# EAGLE design plooter 2 (EAGLE 8.2.1)
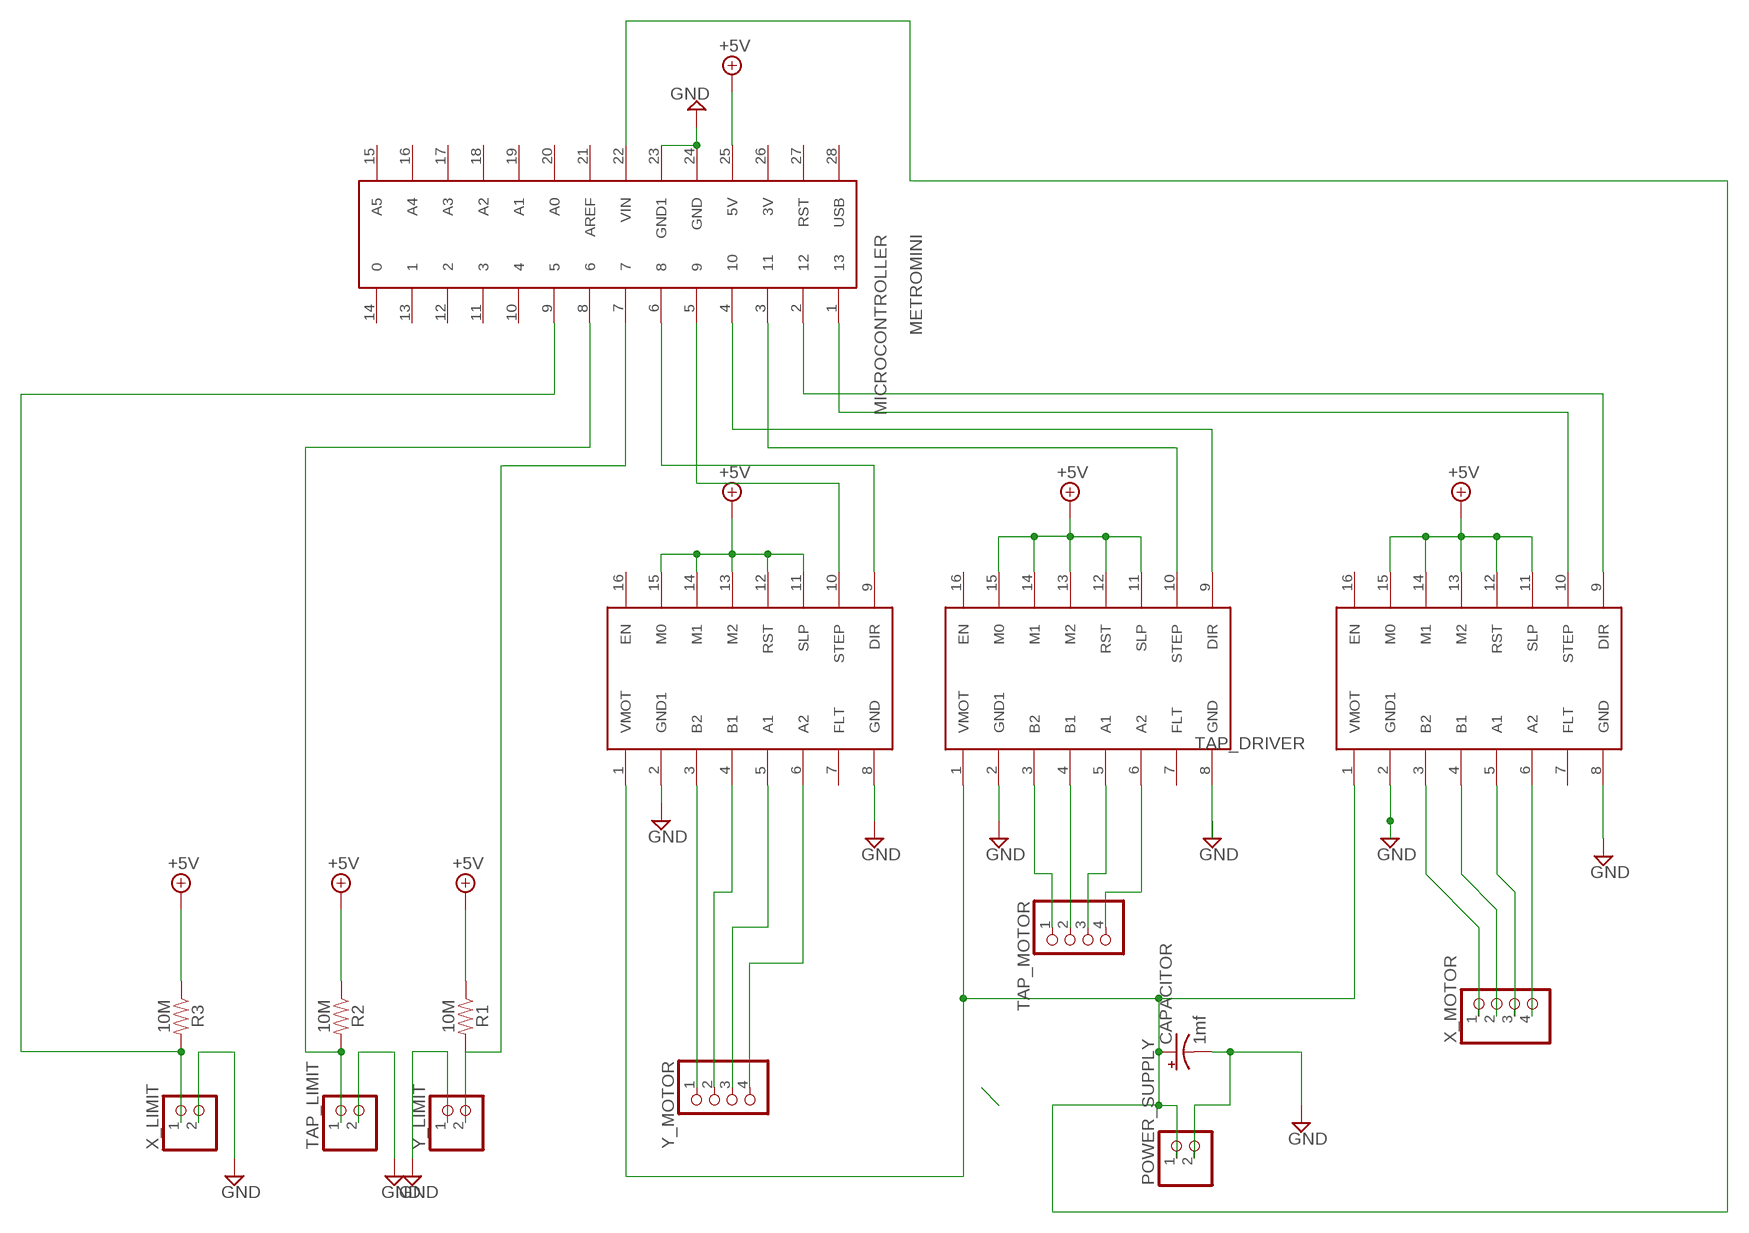
[diagram p0: schematic, sheet 1]

## Parts
CAPACITOR  1mf  1000UF-RADIAL-5MM-35V-20%-KIT  [CPOL-RADIAL-5MM-10MM-KIT]
MICROCONTROLLER  METROMINI  [METROMINI]
POWER_SUPPLY  PINHD-1X2  [1X02]
R1  10M  10MOHM-HORIZ-1/4W-5%  [AXIAL-0.3]
R2  10M  10MOHM-HORIZ-1/4W-5%  [AXIAL-0.3]
R3  10M  10MOHM-HORIZ-1/4W-5%  [AXIAL-0.3]
TAP_DRIVER  DRV8825  [DRV8825]
TAP_LIMIT  PINHD-1X2  [1X02]
TAP_MOTOR  PINHD-1X4  [1X04]
X_DRIVER  DRV8825  [DRV8825]
X_LIMIT  PINHD-1X2  [1X02]
X_MOTOR  PINHD-1X4  [1X04]
Y_DRIVER  DRV8825  [DRV8825]
Y_LIMIT  PINHD-1X2  [1X02]
Y_MOTOR  PINHD-1X4  [1X04]

## Nets
12V [power]: CAPACITOR.+ MICROCONTROLLER.22(VIN) POWER_SUPPLY.1 TAP_DRIVER.1(VMOT) X_DRIVER.1(VMOT) Y_DRIVER.1(VMOT)
+5V [power]: MICROCONTROLLER.25(5V) R1.P$1 R2.P$1 R3.P$1 TAP_DRIVER.11(SLP) TAP_DRIVER.12(RST) TAP_DRIVER.13(M2) TAP_DRIVER.14(M1) TAP_DRIVER.15(M0) X_DRIVER.11(SLP) X_DRIVER.12(RST) X_DRIVER.13(M2) X_DRIVER.14(M1) X_DRIVER.15(M0) Y_DRIVER.11(SLP) Y_DRIVER.12(RST) Y_DRIVER.13(M2) Y_DRIVER.14(M1) Y_DRIVER.15(M0)
GND [gnd]: CAPACITOR.- MICROCONTROLLER.23(GND1) MICROCONTROLLER.24(GND) POWER_SUPPLY.2 TAP_DRIVER.2(GND1) TAP_DRIVER.8(GND) TAP_LIMIT.2 X_DRIVER.2(GND1) X_DRIVER.8(GND) X_LIMIT.2 Y_DRIVER.2(GND1) Y_DRIVER.8(GND) Y_LIMIT.1
N$1: MICROCONTROLLER.7 R1.P$2 Y_LIMIT.2
N$2: MICROCONTROLLER.5 Y_DRIVER.10(STEP)
N$4: MICROCONTROLLER.9 R3.P$2 X_LIMIT.1
N$6: MICROCONTROLLER.6 Y_DRIVER.9(DIR)
N$7: MICROCONTROLLER.3 TAP_DRIVER.10(STEP)
N$8: MICROCONTROLLER.4 TAP_DRIVER.9(DIR)
N$9: MICROCONTROLLER.1 X_DRIVER.10(STEP)
N$11: MICROCONTROLLER.2 X_DRIVER.9(DIR)
N$12: MICROCONTROLLER.8 R2.P$2 TAP_LIMIT.1
N$20: TAP_DRIVER.3(B2) TAP_MOTOR.1
N$21: TAP_DRIVER.4(B1) TAP_MOTOR.2
N$23: TAP_DRIVER.6(A2) TAP_MOTOR.4
N$24: X_DRIVER.3(B2) X_MOTOR.1
N$25: X_DRIVER.4(B1) X_MOTOR.2
N$26: X_DRIVER.5(A1) X_MOTOR.3
N$27: X_DRIVER.6(A2) X_MOTOR.4
N$39: Y_DRIVER.4(B1) Y_MOTOR.2
N$44: TAP_DRIVER.5(A1) TAP_MOTOR.3
N$45: Y_DRIVER.3(B2) Y_MOTOR.1
N$46: Y_DRIVER.5(A1) Y_MOTOR.3
N$48: Y_DRIVER.6(A2) Y_MOTOR.4
Unconnected: MICROCONTROLLER.10 MICROCONTROLLER.11 MICROCONTROLLER.12 MICROCONTROLLER.13 MICROCONTROLLER.14 MICROCONTROLLER.15(A5) MICROCONTROLLER.16(A4) MICROCONTROLLER.17(A3) MICROCONTROLLER.18(A2) MICROCONTROLLER.19(A1) MICROCONTROLLER.20(A0) MICROCONTROLLER.21(AREF) MICROCONTROLLER.26(3V) MICROCONTROLLER.27(RST) MICROCONTROLLER.28(USB) TAP_DRIVER.7(FLT) TAP_DRIVER.16(EN) X_DRIVER.7(FLT) X_DRIVER.16(EN) Y_DRIVER.7(FLT) Y_DRIVER.16(EN)

## Library data of the parts
CAPACITOR = SparkFun-Capacitors:1000UF: 1,000µF/1mF ceramic capacitors A capacitor is a passive two-terminal electrical component used to store electrical energy temporarily in an electric field. CAP-08070; PROD_ID: CAP-09538
MICROCONTROLLER = julian:METROMINI
POWER_SUPPLY TAP_LIMIT X_LIMIT Y_LIMIT = pinhead:PINHD-1X2: PIN HEADER
R1-R3 = SparkFun-Resistors:10MOHM: RES-09327; PROD_ID: RES-09327
TAP_DRIVER X_DRIVER Y_DRIVER = julian:DRV8825
TAP_MOTOR X_MOTOR Y_MOTOR = pinhead:PINHD-1X4: PIN HEADER

## Net classes
0 default: width 0.457 mm, drill 0.457 mm, clearance 0.457 mm
1 power: width 0.457 mm, drill 0.457 mm, clearance 0.457 mm
2 gnd: width 0.457 mm, drill 0.457 mm, clearance 0.457 mm
3 usbvcc: width 0.457 mm, drill 0.457 mm, clearance 0.457 mm
4 aref: width 0.254 mm, drill 0.457 mm, clearance 0.457 mm

## Board
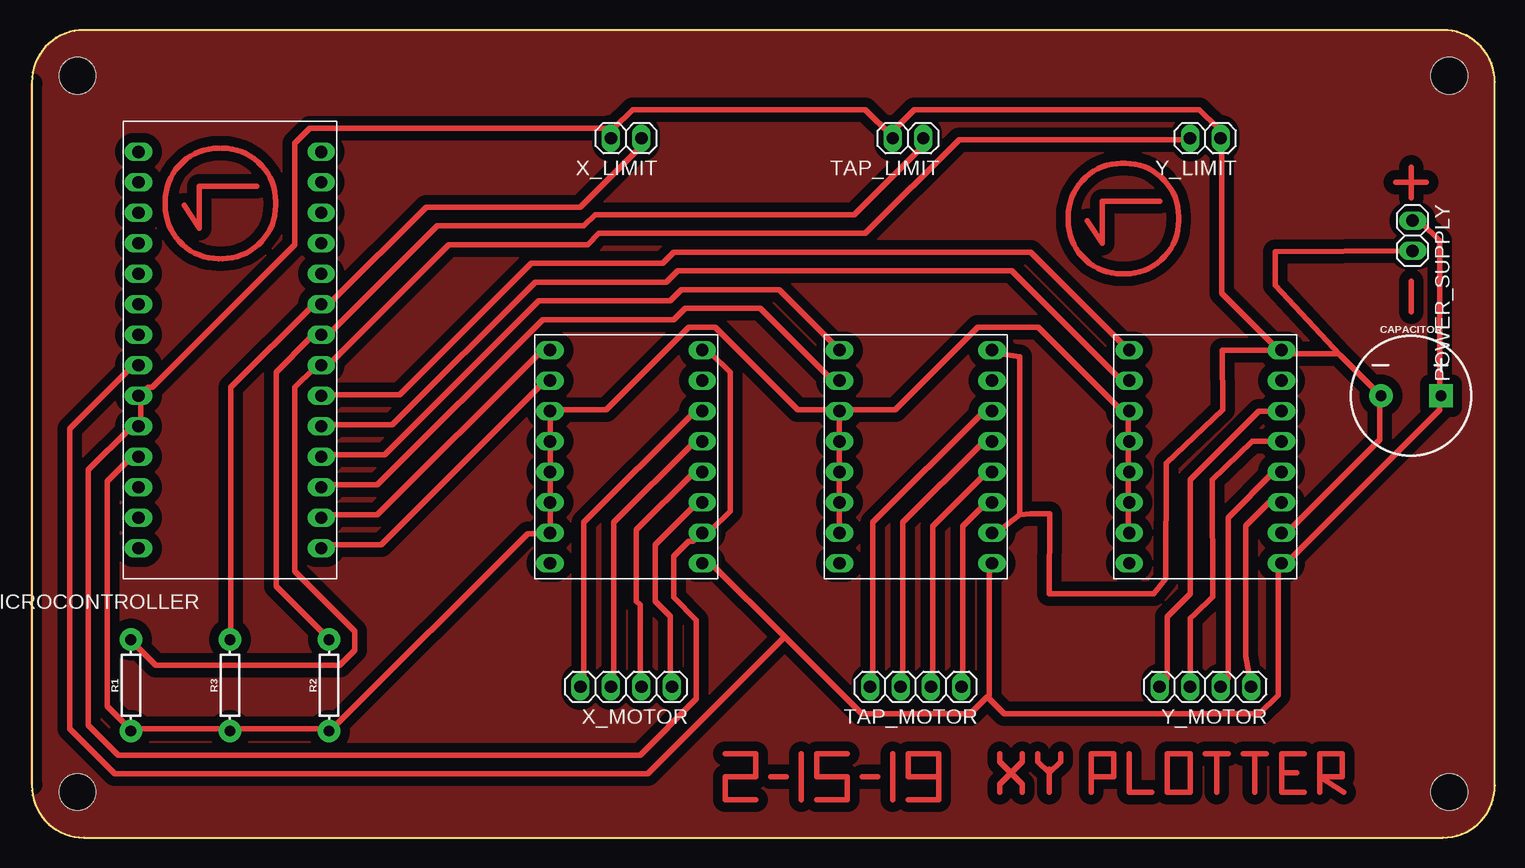
[diagram p1: board, top side]

Size 121.92 x 67.31 mm. Coordinates in mm from the lower left corner, seen from the top.
Outline: 117.58,67.31 4.34,67.31 arc90 0,62.97 0,4.34 arc90 4.34,0 117.58,0 arc90 121.92,4.34 121.92,62.97 arc90 117.58,67.31
Copper layers (1*16): Top 0.035mm / dielectric 1.5mm / Bottom 0.035mm
Design rules "OthermillDRC_1_32_v2": minimum track width 8mil, minimum drill 0.8mm, track to track 0.794003125mm, track to pad 0.794003125mm, pad to pad 0.794003125mm, via to via 0.794003125mm, smd to smd 0mil, copper to edge 0mil, drill to drill 1mil, minimum pad ring 10mil, minimum via ring 10mil, stop-mask expansion 1mil, vias tented up to drill 30mil, thermal gap 10mil
Holes 3.05 mm at 3.81,3.81 118.11,3.81 118.11,63.5 3.81,63.5

### Footprints (pad centres in the part's own frame; a part is rotated, then mirrored left to right if it is on the bottom)
CPOL-RADIAL-5MM-10MM-KIT = drill 0.9 pad 1.93 square: + 2.5,0 | drill 0.9 pad 1.93: - -2.5,0
METROMINI = drill 1.016 long: 1 -16.51,-3.81; 2 -13.97,-3.81; 3 -11.43,-3.81; 4 -8.89,-3.81; 5 -6.35,-3.81; 6 -3.81,-3.81; 7 -1.27,-3.81; 8 1.27,-3.81; 9 3.81,-3.81; 10 6.35,-3.81; 11 8.89,-3.81; 12 11.43,-3.81; 13 13.97,-3.81; 14 16.51,-3.81; 15 16.51,11.43; 16 13.97,11.43; 17 11.43,11.43; 18 8.89,11.43; 19 6.35,11.43; 20 3.81,11.43; 21 1.27,11.43; 22 -1.27,11.43; 23 -3.81,11.43; 24 -6.35,11.43; 25 -8.89,11.43; 26 -11.43,11.43; 27 -13.97,11.43; 28 -16.51,11.43
1X02 = drill 1.016 long: 1 -1.27,0; 2 1.27,0
AXIAL-0.3 = drill 0.9 pad 1.88: P$1 -3.81,0; P$2 3.81,0
DRV8825 = drill 1.016 long: 1 -7.62,-1.27; 2 -5.08,-1.27; 3 -2.54,-1.27; 4 0,-1.27; 5 2.54,-1.27; 6 5.08,-1.27; 7 7.62,-1.27; 8 10.16,-1.27; 9 10.16,11.43; 10 7.62,11.43; 11 5.08,11.43; 12 2.54,11.43; 13 0,11.43; 14 -2.54,11.43; 15 -5.08,11.43; 16 -7.62,11.43
1X04 = drill 1.016 long: 1 -3.81,0; 2 -1.27,0; 3 1.27,0; 4 3.81,0

### Placement (x,y rotation side)
CAPACITOR  114.94,36.83 0 top
MICROCONTROLLER  20.32,40.64 90 top
POWER_SUPPLY  115.06,50.16 270 top
R1  8.26,12.7 90 top
R2  24.77,12.7 90 top
R3  16.51,12.7 90 top
TAP_DRIVER  78.74,30.48 90 top
TAP_LIMIT  73.02,58.29 180 top
TAP_MOTOR  73.66,12.57 180 top
X_DRIVER  54.61,30.48 90 top
X_LIMIT  49.53,58.29 180 top
X_MOTOR  49.53,12.57 180 top
Y_DRIVER  102.87,30.48 90 top
Y_LIMIT  97.79,58.29 180 top
Y_MOTOR  97.79,12.57 180 top

### Tracks (layer width: path | path; a pad name or v marks a point on that pad's centre or on a via)
12V
  Top 0.457: POWER_SUPPLY.1 115.13,51.3 115.75,51.3 117.32,49.73 117.32,36.91 CAPACITOR.+ 117.32,36.6 117.32,35.66 104.81,23.15 104.18,23.15 Y_DRIVER.1 103.87,22.83 103.87,11.89 102.3,10.32 81.03,10.32 79.63,11.73 | 62.74,16.73 69.15,10.32 78.22,10.32 79.63,11.73 | 62.74,16.73 56.64,22.83 56.01,22.83 X_DRIVER.1 | 79.63,11.73 79.78,11.89 79.78,22.83 TAP_DRIVER.1 | 62.74,16.73 51.32,5.32 6.9,5.32 3.15,9.07 3.15,34.09 8.15,39.1 8.78,39.1 MICROCONTROLLER.22
+5V
  Top 0.457: TAP_DRIVER.15 67.27,25.65 67.27,27.84 TAP_DRIVER.14 67.27,28.15 67.27,30.34 TAP_DRIVER.13 67.27,30.65 67.27,32.84 TAP_DRIVER.12 67.27,33.16 67.27,35.35 TAP_DRIVER.11 | Y_DRIVER.15 91.36,25.65 91.36,27.84 Y_DRIVER.14 91.36,28.15 91.36,30.34 Y_DRIVER.13 91.36,30.65 91.36,32.84 Y_DRIVER.12 91.36,33.16 91.36,35.03 | 91.36,35.03 91.36,35.35 Y_DRIVER.11 91.36,35.03 | 91.36,35.03 83.85,42.54 78.84,42.54 71.96,35.66 67.58,35.66 TAP_DRIVER.11 | MICROCONTROLLER.25 8.78,31.59 8.15,31.59 6.28,29.72 6.28,10.95 8.15,9.07 R1.P$1 8.46,9.07 16.28,9.07 R3.P$1 16.6,9.07 24.73,9.07 R2.P$1 25.04,9.07 41.31,25.34 42.87,25.34 X_DRIVER.15 43.19,25.65 43.19,27.84 X_DRIVER.14 43.19,28.15 43.19,30.34 X_DRIVER.13 43.19,30.65 43.19,32.84 X_DRIVER.12 43.19,33.16 43.19,35.35 X_DRIVER.11 43.19,35.66 47.88,35.66 54.76,42.54 56.95,42.54 63.83,35.66 67.27,35.66 TAP_DRIVER.11
GND
  Top 0.457: 82.31,26.93 82.31,28.25 82.31,40.08 80.72,40.35 80.1,40.35 TAP_DRIVER.8 | 82.31,26.93 80.72,25.65 80.1,25.65 TAP_DRIVER.2 | Y_DRIVER.2 104.18,25.65 104.81,25.65 112.31,33.16 112.31,36.6 CAPACITOR.- 112.31,36.91 109.03,40.2 | 109.03,40.2 108.87,40.35 104.18,40.35 Y_DRIVER.8 | 109.03,40.2 103.61,46.03 103.61,48.85 POWER_SUPPLY.2 | Y_DRIVER.8 103.87,40.66 99.18,45.36 99.18,58.18 Y_LIMIT.1 98.86,58.49 98.86,59.12 97.3,60.68 73.53,60.68 71.65,58.81 TAP_LIMIT.2 71.65,58.49 69.46,60.68 50.07,60.68 48.5,59.12 | 82.31,26.93 83.22,26.98 84.83,26.98 84.8,20.32 93.47,20.32 93.49,20.32 94.51,21.59 94.53,31.21 99.23,35.65 99.21,40.64 Y_DRIVER.8 | X_DRIVER.8 56.01,40.35 56.64,40.35 58.2,38.79 58.2,27.21 56.64,25.65 56.01,25.65 X_DRIVER.2 55.7,25.34 55.07,24.71 54.76,24.71 53.51,23.46 53.51,20.02 55.38,18.14 55.38,11.57 50.69,6.88 7.21,6.88 4.71,9.38 4.71,30.65 8.15,34.09 8.78,34.09 MICROCONTROLLER.24 9.09,34.41 9.09,36.6 MICROCONTROLLER.23 9.09,36.91 9.72,37.54 10.03,37.54 21.91,49.42 21.91,57.87 23.17,59.12 48.5,59.12 | 48.5,59.12 48.5,58.49 X_LIMIT.2 48.5,59.12
N$1
  Top 0.457: R1.P$2 8.46,16.27 10.34,14.39 25.67,14.39 26.92,15.64 26.92,17.2 21.91,22.21 21.91,37.54 23.48,39.1 24.1,39.1 MICROCONTROLLER.7 24.42,39.1 34.74,49.42 46.31,49.42 47.25,50.36 69.46,50.36 77.28,58.18 96.36,58.18 Y_LIMIT.2
N$2
  Top 0.457: MICROCONTROLLER.5 24.42,34.41 30.05,34.41 41.93,46.29 52.88,46.29 53.82,47.23 81.66,47.23 90.73,38.16 91.36,38.16 Y_DRIVER.10
N$3
  Top 0.457: 57.79,6.99 60.33,6.99 60.33,5.08 57.79,5.08 57.79,3.17 60.33,3.17
N$4
  Top 0.457: R3.P$2 16.6,16.58 16.6,37.54 23.48,44.42 24.1,44.42 MICROCONTROLLER.9 24.42,44.73 25.04,44.73 32.86,52.55 45.69,52.55 50.69,57.55 50.69,58.18 X_LIMIT.1
N$6
  Top 0.457: MICROCONTROLLER.6 24.42,36.91 30.67,36.91 41.62,47.86 52.57,47.86 53.51,48.8 83.22,48.8 91.36,40.66 Y_DRIVER.9
N$7
  Top 0.457: MICROCONTROLLER.3 24.42,29.4 28.8,29.4 42.56,43.17 53.51,43.17 54.45,44.1 60.7,44.1 66.64,38.16 67.27,38.16 TAP_DRIVER.10
N$8
  Top 0.457: MICROCONTROLLER.4 24.42,31.91 29.42,31.91 42.25,44.73 53.2,44.73 54.13,45.67 62.27,45.67 67.27,40.66 TAP_DRIVER.9
N$9
  Top 0.457: MICROCONTROLLER.1 24.42,24.4 29.11,24.4 42.87,38.16 X_DRIVER.10
N$10
  Top 0.457: 61.6,5.08 62.87,5.08
N$11
  Top 0.457: MICROCONTROLLER.2 24.42,26.9 28.8,26.9 42.25,40.35 42.87,40.35 X_DRIVER.9
N$12
  Top 0.457: R2.P$2 24.73,16.58 20.35,20.96 20.35,38.79 23.17,41.6 24.1,41.6 MICROCONTROLLER.8 24.42,41.6 33.8,50.99 46,50.99 46.94,51.92 68.52,51.92 74.15,57.55 74.15,58.18 TAP_LIMIT.1
N$13
  Top 0.457: 114.94,53.34 114.94,55.88
N$14
  Top 0.457: 113.66,54.61 116.2,54.61
N$15
  Top 0.457: 114.94,46.35 114.94,43.81
N$16
  Top 0.457: 64.14,6.99 64.14,3.17
N$17
  Top 0.457: 67.94,6.99 65.41,6.99 65.41,5.08 67.94,5.08 67.94,3.17 65.41,3.17
N$18
  Top 0.457: 69.21,5.08 70.48,5.08
N$19
  Top 0.457: 71.75,6.99 71.75,3.17
N$20
  Top 0.457: TAP_MOTOR.1 77.59,12.82 77.59,25.96 79.78,28.15 TAP_DRIVER.3
N$21
  Top 0.457: TAP_MOTOR.2 75.09,12.82 75.09,25.96 79.78,30.65 TAP_DRIVER.4
N$22
  Top 0.457: 75.56,5.08 73.02,5.08 73.02,6.99 75.56,6.99 75.56,5.08 | 75.56,5.08 75.56,3.17 73.02,3.17
N$23
  Top 0.457: TAP_MOTOR.4 70.09,12.82 70.09,26.27 79.16,35.35 79.78,35.35 TAP_DRIVER.6
N$24
  Top 0.457: X_MOTOR.1 53.2,12.82 53.2,18.45 51.94,19.71 51.94,24.4 55.7,28.15 X_DRIVER.3
N$25
  Top 0.457: X_MOTOR.2 50.69,12.82 50.69,19.39 50.38,19.71 50.38,25.65 55.07,30.34 55.7,30.34 X_DRIVER.4
N$26
  Top 0.457: X_MOTOR.3 48.5,12.82 48.5,26.27 55.07,32.84 55.7,32.84 X_DRIVER.5
N$27
  Top 0.457: X_MOTOR.4 46,12.82 46,26.27 55.07,35.35 55.7,35.35 X_DRIVER.6
N$28
  Top 0.457: 82.55,6.99 82.55,6.35 80.64,4.45 80.64,3.81
N$29
  Top 0.457: 80.64,6.99 80.64,6.35 82.55,4.45 82.55,3.81
N$30
  Top 0.457: 83.82,6.99 83.82,6.35 84.77,5.4 | 84.77,5.71 84.77,5.4 | 84.77,5.4 84.77,3.81 | 85.72,6.99 85.72,6.35 84.77,5.4
N$31
  Top 0.457: 88.27,5.08 88.27,6.99 90.17,6.99 90.17,5.08 88.27,5.08 | 88.27,5.08 88.27,3.81
N$32
  Top 0.457: 91.44,6.99 91.44,3.81 93.34,3.81
N$33
  Top 0.457: 94.61,6.99 94.61,3.81 96.52,3.81 96.52,6.99 94.61,6.99
N$34
  Top 0.457: 97.79,6.99 98.74,6.99 | 98.74,6.99 99.69,6.99 | 98.74,6.99 98.74,3.81
N$35
  Top 0.457: 100.96,6.99 101.92,6.99 | 101.92,6.99 102.55,6.99 102.87,6.99 | 101.92,6.99 101.92,3.81
N$36
  Top 0.457: 104.14,5.4 104.14,6.99 106.05,6.99 | 104.14,5.4 104.14,3.81 106.05,3.81 | 104.14,5.4 105.41,5.4
N$37
  Top 0.457: 107.31,5.08 107.31,6.99 109.22,6.99 109.22,5.08 107.31,5.08 | 107.31,5.08 107.31,3.81 | 107.31,5.08 109.35,3.81
N$38
  Top 0.457: 15.88,48.26 arc90 20.32,52.7 20.32,53.02 arc90 15.88,57.47 | 15.56,48.26 arc-90 11.11,52.7 11.11,53.02 arc-90 15.56,57.47
N$39
  Top 0.457: Y_DRIVER.4 103.5,30.48 99.69,26.67 99.69,13.34 99.06,12.7 Y_MOTOR.2
N$40
  Top 0.457: 95.57,51.44 arc-90 91.12,46.99 90.8,46.99 arc-90 86.36,51.44 86.36,51.75 arc-90 90.8,56.2 91.12,56.2 arc-90 95.57,51.75 95.57,51.44
N$41
  Top 0.457: 87.95,51.44 89.22,49.53 89.22,53.02 93.98,53.02
N$42
  Top 0.457: 12.7,52.7 13.97,50.8 13.97,54.29 18.73,54.29
N$43
  Top 0.152: 0,4.45 0,62.87
N$44
  Top 0.457: TAP_MOTOR.3 72.59,12.82 72.59,26.27 79.16,32.84 79.78,32.84 TAP_DRIVER.5
N$45
  Top 0.457: Y_MOTOR.1 101.17,15.14 101.17,26 103.13,27.97 Y_DRIVER.3
N$46
  Top 0.457: Y_MOTOR.3 96.52,18.29 96.93,18.63 98.4,20.07 98.38,29.82 101.71,33.03 Y_DRIVER.5
N$47
  pour Top: 0,62.87 0,4.45 arc90 4.45,0 117.47,0 arc90 121.92,4.45 121.92,62.87 arc90 117.47,67.31 4.45,67.31 arc90
N$48
  Top 0.457: Y_DRIVER.6 102.23,35.56 96.52,29.84 96.52,20.32 94.61,18.41 94.61,13.34 93.98,12.7 Y_MOTOR.4